# EAGLE design Group_10 (EAGLE 9.6.2)

## Sheet 1 of 2
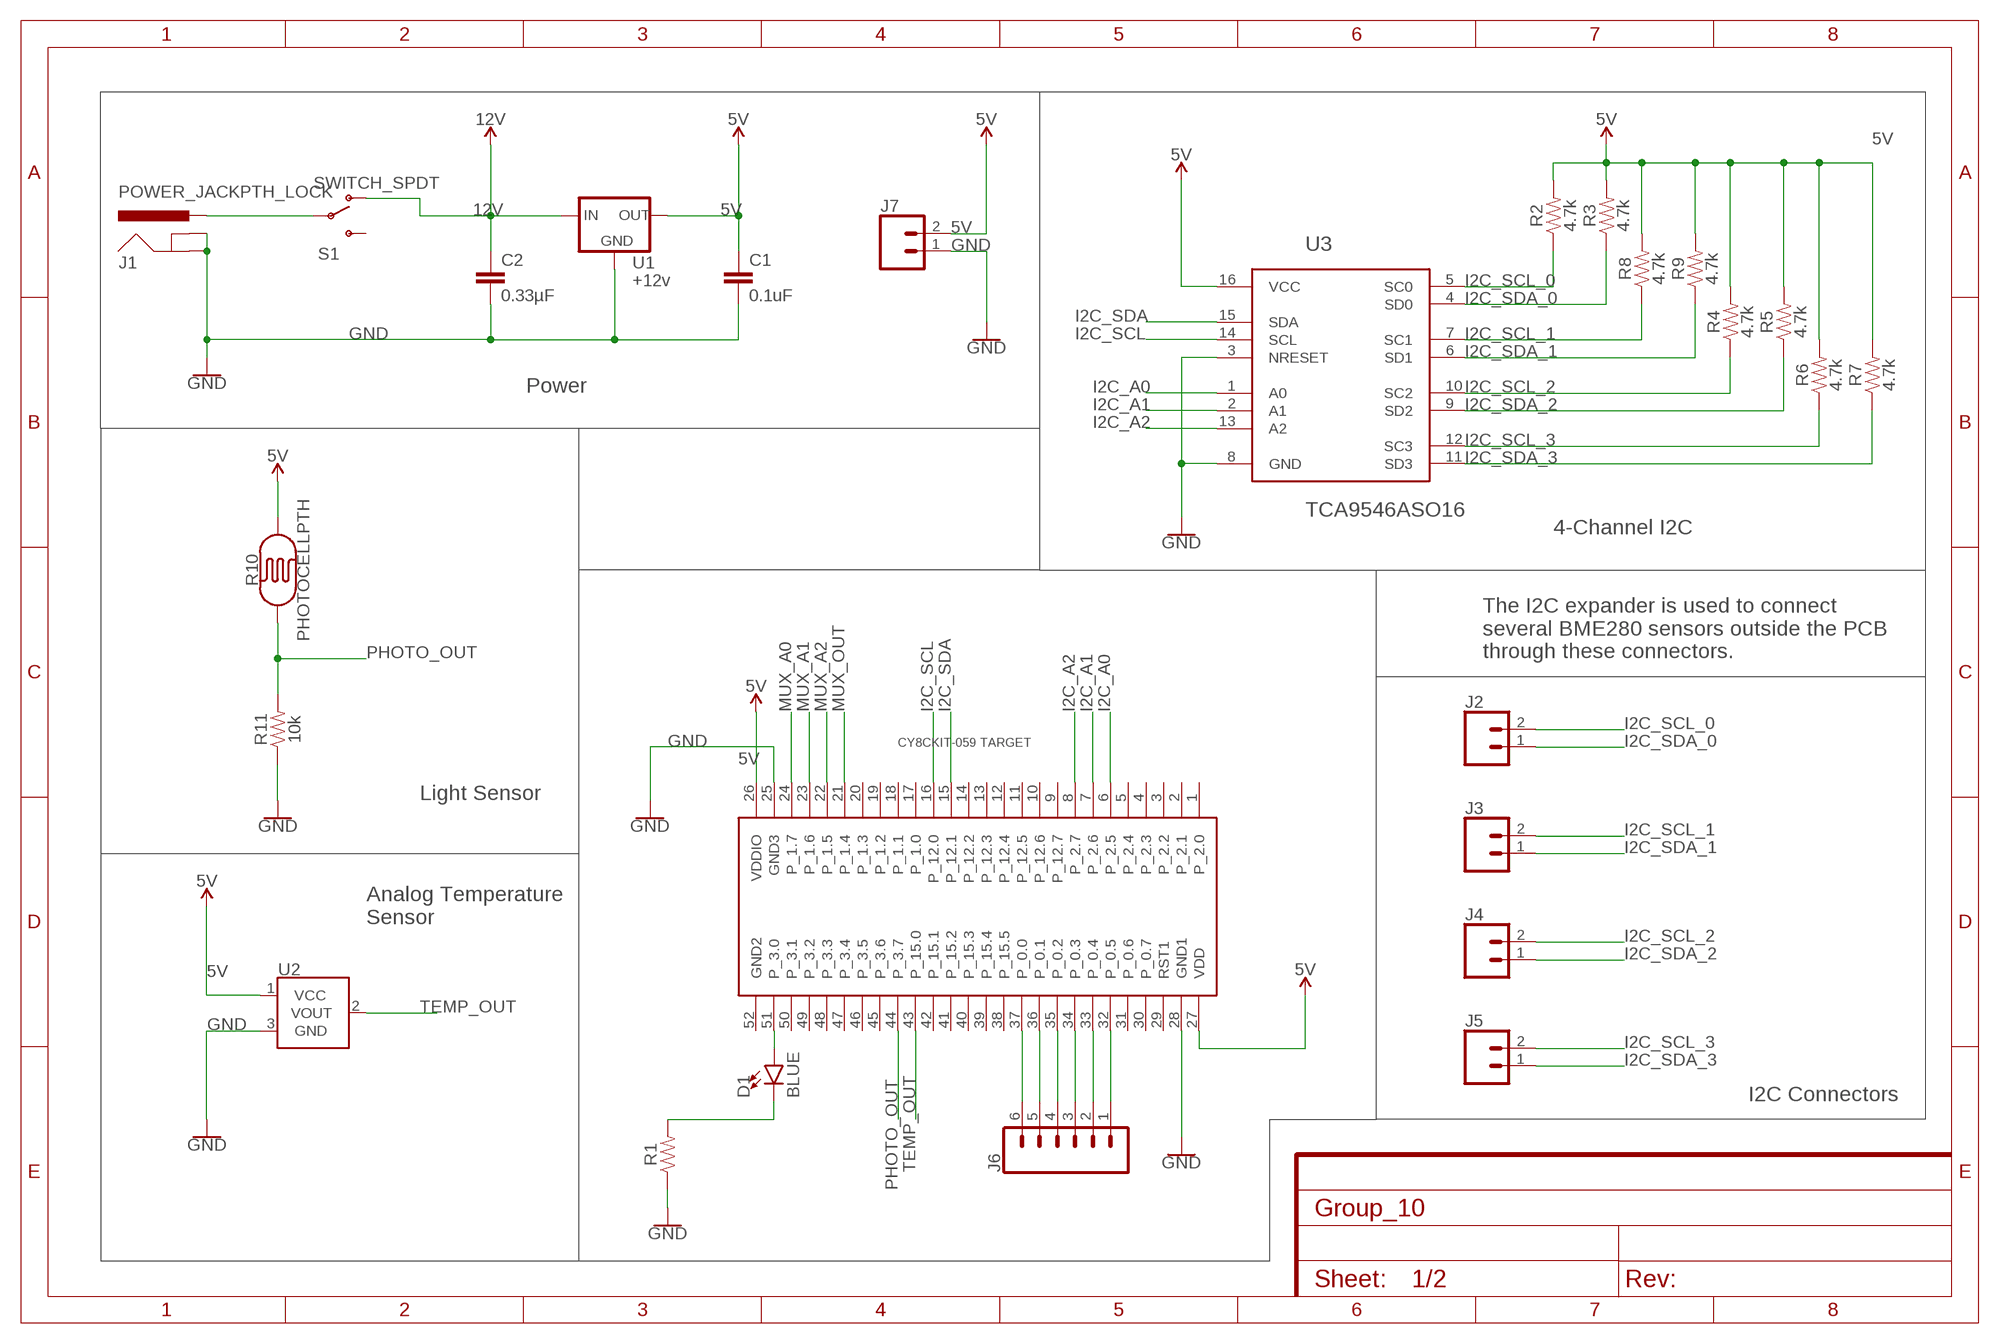
[diagram p0: schematic, sheet 1]

### Parts
C1  0.1uF  0.1UF-KIT-EZ-50V-20%  [CAP-PTH-SMALL-KIT]
C2  0.33µF  0.33UF/330NF-0805-50V-10%  [0805]
D1  BLUE  LED-BLUE1206  [LED-1206]
J1  POWER_JACKPTH_LOCK  [POWER_JACK_PTH_LOCK]
J2  CONN_02  [1X02]
J3  CONN_02  [1X02]
J4  CONN_02  [1X02]
J5  CONN_02  [1X02]
J6  CONN_06LOCK  [1X06_LOCK]
J7  CONN_02  [1X02]
R1  RESISTORAXIAL-0.3  [AXIAL-0.3]
R2  4.7k  4.7KOHM-0603-1/10W-1%  [0603]
R3  4.7k  4.7KOHM-0603-1/10W-1%  [0603]
R4  4.7k  4.7KOHM-0603-1/10W-1%  [0603]
R5  4.7k  4.7KOHM-0603-1/10W-1%  [0603]
R6  4.7k  4.7KOHM-0603-1/10W-1%  [0603]
R7  4.7k  4.7KOHM-0603-1/10W-1%  [0603]
R8  4.7k  4.7KOHM-0603-1/10W-1%  [0603]
R9  4.7k  4.7KOHM-0603-1/10W-1%  [0603]
R10  PHOTOCELLPTH  [PHOTOCELL]
R11  10k  10KOHM-0603-1/10W-1%  [0603]
S1  SWITCH_SPDT  [KPS-1290]
U1  +12v  V_REG_78XX7812  [TO-252]
U2  TMP36GT9  [TO-92]
U3  TCA9546ASO16  [TSSOP16]
U$2  CY8CKIT-059_TARGET_3  [CY8CKIT-059_TARGET_3]

### Nets
5V: C1.1 J7.2 R2.2 R3.2 R4.2 R5.2 R6.2 R7.2 R8.2 R9.2 R10.2 U1.2(OUT) U2.1(VCC) U3.16(VCC) U$2.26(VDDIO) U$2.27(VDD) ; also sheet 2
12V: C2.1 S1.O U1.1(IN)
GND: C1.2 C2.2 J1.GND J1.GNDBREAK J7.1 R1.P$1 R11.1 U1.3(GND) U2.3(GND) U3.3(NRESET) U3.8(GND) U$2.25(GND3) U$2.28(GND1) ; also sheet 2
I2C_A0: U3.1(A0) U$2.6(P_2.5)
I2C_A1: U3.2(A1) U$2.7(P_2.6)
I2C_A2: U3.13(A2) U$2.8(P_2.7)
I2C_SCL: U3.14(SCL) U$2.16(P_12.0)
I2C_SCL_0: J2.2 R2.1 U3.5(SC0)
I2C_SCL_1: J3.2 R8.1 U3.7(SC1)
I2C_SCL_2: J4.2 R4.1 U3.10(SC2)
I2C_SCL_3: J5.2 R6.1 U3.12(SC3)
I2C_SDA: U3.15(SDA) U$2.15(P_12.1)
I2C_SDA_0: J2.1 R3.1 U3.4(SD0)
I2C_SDA_1: J3.1 R9.1 U3.6(SD1)
I2C_SDA_2: J4.1 R5.1 U3.9(SD2)
I2C_SDA_3: J5.1 R7.1 U3.11(SD3)
MUX_A0: U$2.24(P_1.7) ; also sheet 2
MUX_A1: U$2.23(P_1.6) ; also sheet 2
MUX_A2: U$2.22(P_1.5) ; also sheet 2
MUX_OUT: U$2.21(P_1.4) ; also sheet 2
N$1: J1.PWR S1.P
N$2: D1.A U$2.51(P_3.0)
N$3: D1.C R1.P$2
N$4: J6.1 U$2.32(P_0.5)
N$5: J6.2 U$2.33(P_0.4)
N$6: J6.3 U$2.34(P_0.3)
N$7: J6.4 U$2.35(P_0.2)
N$8: J6.5 U$2.36(P_0.1)
N$9: J6.6 U$2.37(P_0.0)
PHOTO_OUT: R10.1 R11.2 U$2.44(P_3.7)
TEMP_OUT: U2.2(VOUT) U$2.43(P_15.0)
Unconnected: S1.S U$2.1(P_2.0) U$2.2(P_2.1) U$2.3(P_2.2) U$2.4(P_2.3) U$2.5(P_2.4) U$2.9(P_12.7) U$2.10(P_12.6) U$2.11(P_12.5) U$2.12(P_12.4) U$2.13(P_12.3) U$2.14(P_12.2) U$2.17(P_1.0) U$2.18(P_1.1) U$2.19(P_1.2) U$2.20(P_1.3) U$2.29(RST1) U$2.30(P_0.7) U$2.31(P_0.6) U$2.38(P_15.5) U$2.39(P_15.4) U$2.40(P_15.3) U$2.41(P_15.2) U$2.42(P_15.1) U$2.45(P_3.6) U$2.46(P_3.5) U$2.47(P_3.4) U$2.48(P_3.3) U$2.49(P_3.2) U$2.50(P_3.1)

### Notes on the sheet
- Power
- 4-Channel I2C
- The I2C expander is used to connect 
  several BME280 sensors outside the PCB
  through these connectors.
- Light Sensor
- Analog Temperature
  Sensor
- I2C Connectors

## Sheet 2 of 2
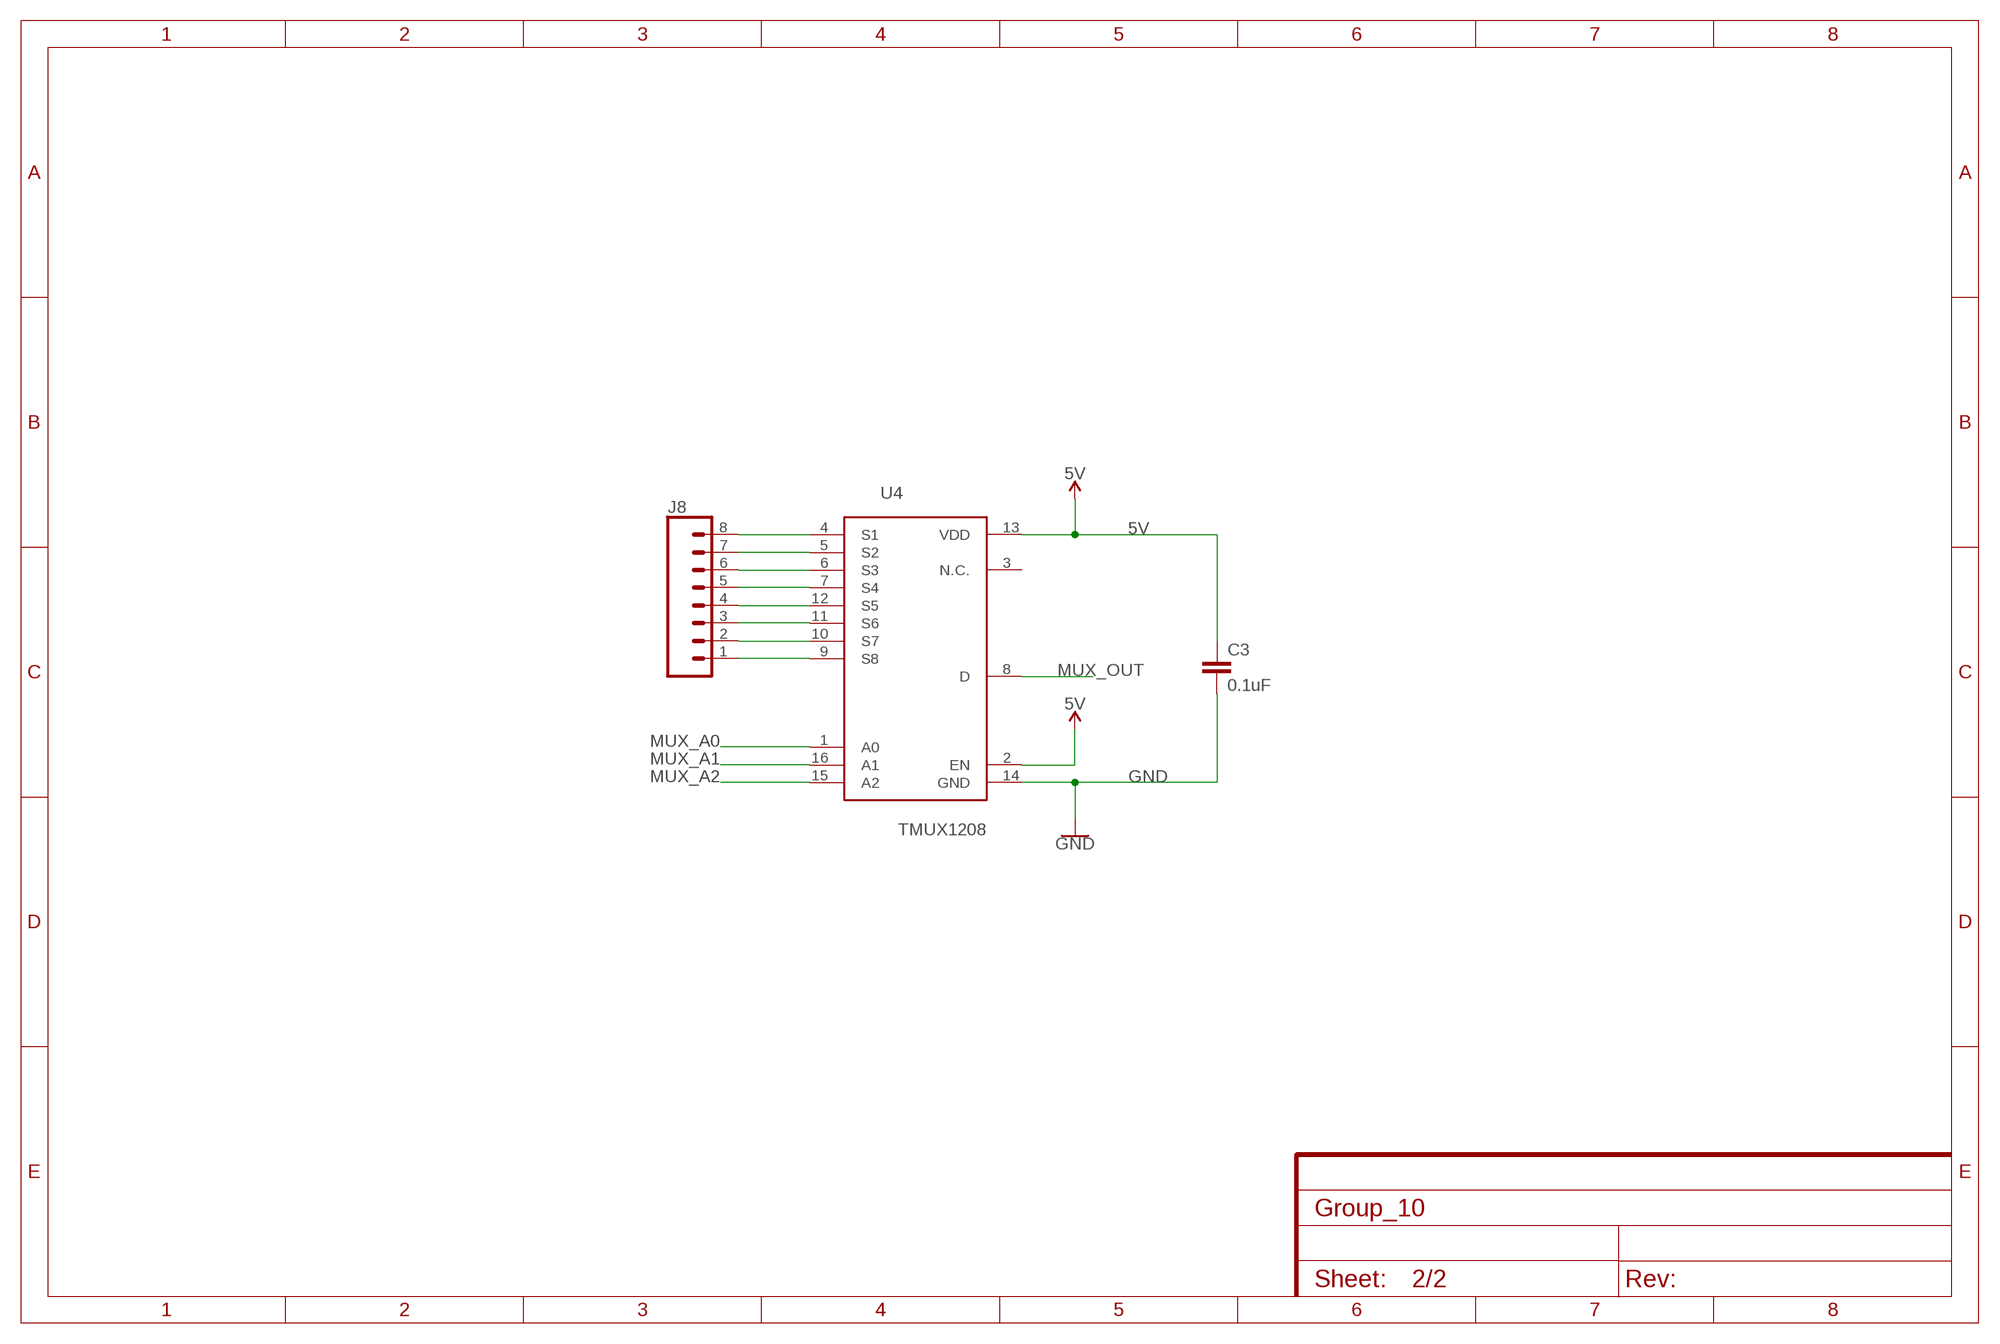
[diagram p1: schematic, sheet 2]

### Parts
C3  0.1uF  0.1UF-KIT-EZ-50V-20%  [CAP-PTH-SMALL-KIT]
J8  CONN_08"  [1X08]
U4  TMUX1208  [QFN16]

### Nets
5V: C3.1 U4.2(EN) U4.13(VDD) ; also sheet 1
GND: C3.2 U4.14(GND) ; also sheet 1
MUX_A0: U4.1(A0) ; also sheet 1
MUX_A1: U4.16(A1) ; also sheet 1
MUX_A2: U4.15(A2) ; also sheet 1
MUX_OUT: U4.8(D) ; also sheet 1
N$10: J8.8 U4.4(S1)
N$11: J8.7 U4.5(S2)
N$12: J8.6 U4.6(S3)
N$13: J8.5 U4.7(S4)
N$14: J8.4 U4.12(S5)
N$15: J8.3 U4.11(S6)
N$16: J8.2 U4.10(S7)
N$17: J8.1 U4.9(S8)
Unconnected: U4.3(N.C.)

## Power pins joined to a net without a drawn wire
GND2: U$2.52(GND2)

## Library data of the parts
C1 C3 = SparkFun-Capacitors:0.1UF: 0.1µF ceramic capacitors A capacitor is a passive two-terminal electrical component used to store electrical energy temporarily in an electric field.; PROD_ID: CAP-08370
C2 = SparkFun-Capacitors:0.33UF/330NF: 0.33µF/330nF ceramic capacitors A capacitor is a passive two-terminal electrical component used to store electrical energy temporarily in an electric field.; PROD_ID: CAP-08469
D1 = SparkFun-LED:LED-BLUE: Blue SMD LED Used in manufacturing of various products at SparkFun Packages: 0603 - SMD 0603 package [Product Link] <http://www.digikey.com/product-detail/en/SMLE12BC7TT86/511-1589-2-ND/1641808> 1206 - SMD1206 package [Product Link] <http://www.digikey.com/product-detail/en/lite-on-inc/LTST-C150TBKT/160-1643-1-ND/573584> SparkFun Products: ESP8266 Thing-Dev Board <https://www.sparkfun.com/products/13711> RedBoard <https://www.sparkfun.com/products/12757>; PROD_ID: DIO-09911
J1 = SparkFun-Connectors:POWER_JACK: Power Jack Connector This is the standard 5.5mm barrel jack for power. The PTH is the most common, proven, reliable, footprint. The Slot footprint only works if the mill layer is transmitted to the PCB fab house so be warned. Here are the connectors we sell at SparkFun: DC Barrel Power Jack/Connector <https://www.sparkfun.com/products/119> (PRT-00119) DC Barrel Power Jack/Connector (SMD) <https://www.sparkfun.com/products/12748> (PRT-12748) DC Barrel Jack Adapter - Breadboard Compatible <https://www.sparkfun.com/products/10811> (PRT-10811) It is used on this SparkFun product (and many, many others): SparkFun RedBoard - Programmed with Arduino <https://www.sparkfun.com/products/12757> (DEV-12757) Also, if you need a mating power supply or connector, please check these out: Wall Adapter Power Supply - 9VDC 650mA <https://www.sparkfun.com/products/298> (TOL-00298) DC Barrel Jack Adapter - Male <https://www.sparkfun.com/products/10287> (PRT-10287); PROD_ID: CONN-08197; SF_ID: PRT-00119
J2-J5 J7 = SparkFun-Connectors:CONN_02: Multi connection point. Often used as Generic Header-pin footprint for 0.1 inch spaced/style header connections On any of the 0.1 inch spaced packages, you can populate with these: Break Away Headers - Straight <https://www.sparkfun.com/products/116> (PRT-00116) Break Away Male Headers - Right Angle <https://www.sparkfun.com/products/553> (PRT-00553) Female Headers <https://www.sparkfun.com/products/115> (PRT-00115) Break Away Headers - Machine Pin <https://www.sparkfun.com/products/117> (PRT-00117) Break Away Female Headers - Swiss Machine Pin <https://www.sparkfun.com/products/743> (PRT-00743) For SCREWTERMINALS and SPRING TERMINALS visit here: Screw Terimnals on SparkFun.com <https://www.sparkfun.com/search/results?term=Screw+Terminals> (5mm/3.5mm/2.54mm spacing) This device is also useful as a general connection point to wire up your design to another part of your project. Our various solder wires solder well into these plated through hole pads. Hook-Up Wire - Assortment (Stranded, 22 AWG) <https://www.sparkfun.com/products/11375> (PRT-11375) Hook-Up Wire - Assortment (Solid Core, 22 AWG) <https://www.sparkfun.com/products/11367> (PRT-11367) View the entire wire category on our website here <https://www.sparkfun.com/categories/141> Special notes: Molex polarized connector foot print use with: PRT-08233 with associated crimp pins and housings. 2.54_SCREWTERM for use with PRT-10571. 3.5mm Screw Terminal footprints for PRT-08084 5mm Screw Terminal footprints for use with PRT-08432
J6 = SparkFun-Connectors:CONN_06: Multi connection point. Often used as Generic Header-pin footprint for 0.1 inch spaced/style header connections On any of the 0.1 inch spaced packages, you can populate with these: Break Away Headers - Straight <https://www.sparkfun.com/products/116> (PRT-00116) Break Away Male Headers - Right Angle <https://www.sparkfun.com/products/553> (PRT-00553) Female Headers <https://www.sparkfun.com/products/115> (PRT-00115) Break Away Headers - Machine Pin <https://www.sparkfun.com/products/117> (PRT-00117) Break Away Female Headers - Swiss Machine Pin <https://www.sparkfun.com/products/743> (PRT-00743) Arduino Stackable Header - 6 Pin <https://www.sparkfun.com/products/9280> (PRT-09280) For SCREWTERMINALS and SPRING TERMINALS visit here: Screw Terimnals on SparkFun.com <https://www.sparkfun.com/search/results?term=Screw+Terminals> (5mm/3.5mm/2.54mm spacing) This device is also useful as a general connection point to wire up your design to another part of your project. Our various solder wires solder well into these plated through hole pads. Hook-Up Wire - Assortment (Stranded, 22 AWG) <https://www.sparkfun.com/products/11375> (PRT-11375) Hook-Up Wire - Assortment (Solid Core, 22 AWG) <https://www.sparkfun.com/products/11367> (PRT-11367) View the entire wire category on our website here <https://www.sparkfun.com/categories/141>
J8 = SparkFun-Connectors:CONN_08: Multi connection point. Often used as Generic Header-pin footprint for 0.1 inch spaced/style header connections On any of the 0.1 inch spaced packages, you can populate with these: Break Away Headers - Straight <https://www.sparkfun.com/products/116> (PRT-00116) Break Away Male Headers - Right Angle <https://www.sparkfun.com/products/553> (PRT-00553) Female Headers <https://www.sparkfun.com/products/115> (PRT-00115) Break Away Headers - Machine Pin <https://www.sparkfun.com/products/117> (PRT-00117) Break Away Female Headers - Swiss Machine Pin <https://www.sparkfun.com/products/743> (PRT-00743) Arduino Stackable Header - 8 Pin <https://www.sparkfun.com/products/9279> (PRT-09279) For SCREWTERMINALS and SPRING TERMINALS visit here: Screw Terimnals on SparkFun.com <https://www.sparkfun.com/search/results?term=Screw+Terminals> (5mm/3.5mm/2.54mm spacing) This device is also useful as a general connection point to wire up your design to another part of your project. Our various solder wires solder well into these plated through hole pads. Hook-Up Wire - Assortment (Stranded, 22 AWG) <https://www.sparkfun.com/products/11375> (PRT-11375) Hook-Up Wire - Assortment (Solid Core, 22 AWG) <https://www.sparkfun.com/products/11367> (PRT-11367) View the entire wire category on our website here <https://www.sparkfun.com/categories/141> Special notes: Molex polarized connector foot print use with SKU : PRT-08231 with associated crimp pins and housings. 1MM SMD Version SKU: PRT-10208 NOTES ON THE VARIANTS LOCK and LOCK_LONGPADS... This footprint was designed to help hold the alignment of a through-hole component (i.e. 6-pin header) while soldering it into place. You may notice that each hole has been shifted either up or down by 0.005 of an inch from it's more standard position (which is a perfectly straight line). This slight alteration caused the pins (the squares in the middle) to touch the edges of the holes. Because they are alternating, it causes a "brace" to hold the component in place. 0.005 has proven to be the perfect amount of "off-center" position when using our standard breakaway headers. Although looks a little odd when you look at the bare footprint, once you have a header in there, the alteration is very hard to notice. Also,if you push a header all the way into place, it is covered up entirely on the bottom side.; PROD_ID: CONN-08438
R1 = SparkFun-Resistors:RESISTOR: Generic Resistor Package
R2-R9 = SparkFun-Resistors:4.7KOHM: 4.7kΩ resistor A resistor is a passive two-terminal electrical component that implements electrical resistance as a circuit element. Resistors act to reduce current flow, and, at the same time, act to lower voltage levels within circuits. - Wikipedia; PROD_ID: RES-07857
R10 = SparkFun-Sensors:PHOTOCELL: Photocell (Photodetector, Photo Resistor, CdS) This is a very small light sensor. A photocell changes (also called a photodetector, photo resistor, CdS or photoconductive cell) resistance depending on the amount of light it is exposed to. These little sensors make great ambient light triggers (when light in the room turns on, do something). Datasheet <http://cdn.sparkfun.com/datasheets/Sensors/LightImaging/SEN-09088.pdf> SparkFun Products Mini Photocell <https://www.sparkfun.com/products/9088> (SEN-09088); PROD_ID: COMP-09129; SF_ID: SEN-09088
R11 = SparkFun-Resistors:10KOHM: 10kΩ resistor A resistor is a passive two-terminal electrical component that implements electrical resistance as a circuit element. Resistors act to reduce current flow, and, at the same time, act to lower voltage levels within circuits. - Wikipedia; PROD_ID: RES-00824
S1 = SparkFun-Retired:SWITCH_SPDT: SWCH-10651 Side-actuated SPDT slide switch, as used on the Arduino Pro; PROD_ID: SWCH-10651
U1 = SparkFun-IC-Power:V_REG_78XX: Voltage Regulator Standard 78xx regulator. IGO (Input Ground Output). Spark Fun Electronics SKU : COM-00107; PROD_ID: VREG-12370
U2 = SparkFun-Sensors:TMP36: TMP36 Precision Analog °C Temperature Sensor The TMP36 is a low voltage, precision centigrade temperature sensor. It provides a voltage output that is linearly proportional to the Celsius temperature. It also doesn’t require any external calibration to provide typical accuracies of ±1°C at +25°C and ±2°C over the −40°C to +125°C temperature range. We like it because it’s so easy to use: Just give the device a ground and 2.7 to 5.5 VDC and read the voltage on the Vout pin. The output voltage can be converted to temperature easily using the scale factor of 10 mV/°C. Datasheet <http://cdn.sparkfun.com/datasheets/Sensors/Temp/TMP35_36_37.pdf> SparkFun Products Temperature Sensor - TMP36 <https://www.sparkfun.com/products/10988> (SEN-10988) SparkFun Danger Shield <https://www.sparkfun.com/products/11649> (DEV-11649); PROD_ID: IC-09880; SF_ID: SEN-10988
U3 = Group_10_Library:TCA9546A: TCA9546A DESCRIPTION The TCA9546A is a quad bidirectional translating switch controlled via the I2C bus. The SCL/SDA upstream pair fans out to four downstream pairs, or channels. Any individual SCn/SDn channel or combination of channels can be selected, determined by the contents of the programmable control register. An active-low reset (RESET) input allows the TCA9546A to recover from a situation in which one of the downstream I2C buses is stuck in a low state. Pulling RESET low resets the I2C state machine and causes all the channels to be deselected, as does the internal power-on reset function. The pass gates of the switches are constructed such that the VCC pin can be used to limit the maximum high voltage, which will be passed by the TCA9546A. This allows the use of different bus voltages on each pair, so that 1.8-V, 2.5-V, or 3.3-V parts can communicate with 5-V parts without any additional protection. External pull-up resistors pull the bus up to the desired voltage level for each channel. All I/O pins are 5.5-V tolerant.
U4 = Group_10_Library:TMUX1208: TMUX1208 DESCRIPTION The TMUX1208 is general purpose complementary metal-oxide semiconductor (CMOS) multiplexers (MUX). The TMUX1208 offers 8:1 singleended channels. Wide operating supply of 1.08 V to 5.5 V allows for use in a broad array of applications from personal electronics to building automation applications. The device supports bidirectional analog and digital signals on the source (Sx) and drain (D) pins ranging from GND to VDD. All logic inputs have 1.8 V logic compatible thresholds, ensuring both TTL and CMOS logic compatibility when operating in the valid supply voltage range. Fail-Safe Logic circuitry allows voltages on the control pins to be applied before the supply pin, protecting the device from potential damage. FEATURES • Rail to Rail Operation • Bidirectional Signal Path • Low On-Resistance: 5 Ω • Wide Supply Range: 1.08 V to 5.5 V • -40°C to +125°C Operating Temperature • 1.8 V Logic Compatible • Fail-Safe Logic • Low Supply Current: 10 nA • Transition Time: 14 ns • Break-Before-Make Switching • ESD Protection HBM: 2000 V • Industry-Standard TSSOP and QFN Packages APPLICATIONS • Analog and Digital Multiplexing / Demultiplexing • HVAC: Heating, Ventilation, and Air Conditioning • Smoke Detectors • Video Surveillance • Electronic Point of Sale • Battery-Powered Equipment • Appliances • Consumer Audio
U$2 = CY8KIT-059:CY8CKIT-059_TARGET_3: CY8CKIT-059 Target This device exposes the pins of the target section of the CY8CKIT-059. This footprint is the one that you will use most of the times, since only the pins of the target section will be then soldered to your PCB.

## Board
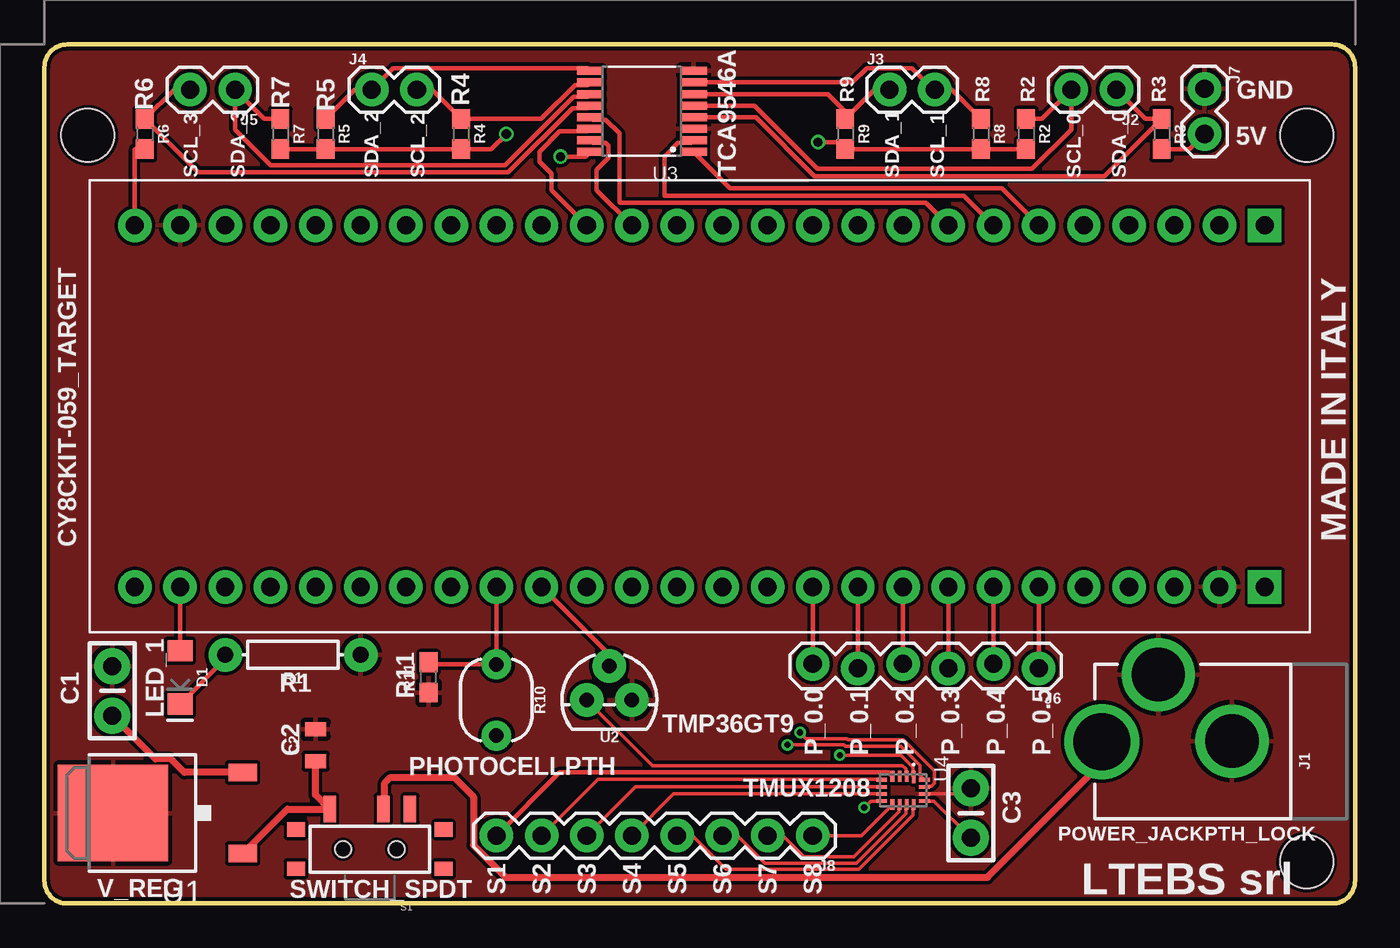
[diagram p2: board, top side]
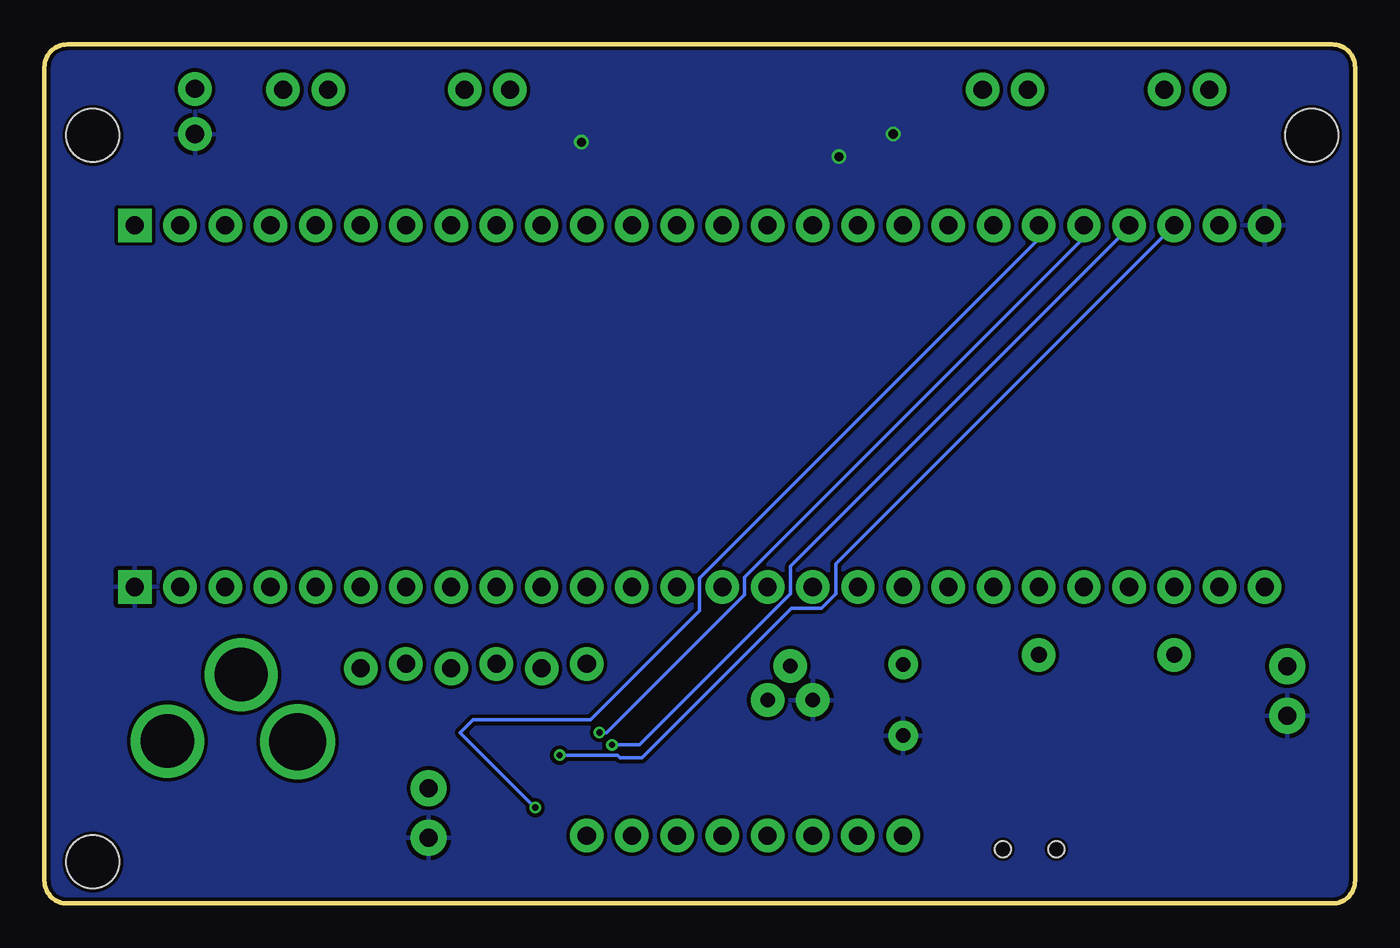
[diagram p3: board, bottom side, seen from below]

Size 73.66 x 48.26 mm. Coordinates in mm from the lower left corner, seen from the top.
Outline: 73.66,46.99 73.66,1.27 arc-90 72.39,0 1.27,0 arc-90 0,1.27 0,46.99 arc-90 1.27,48.26 72.39,48.26 arc-90 73.66,46.99
Copper layers (1*16): Top 0.035mm / dielectric 0.15mm / Bottom 0.035mm
Design rules "Group_10 *": minimum track width 6mil, minimum drill 8mil, track to track 6mil, track to pad 6mil, pad to pad 6mil, via to via 6mil, smd to smd 6mil, copper to edge 8mil, drill to drill 6mil, minimum pad ring 8mil, minimum via ring 6mil, stop-mask expansion 8mil, vias tented up to drill 20mil, thermal gap 10mil
Holes 3 mm at 2.44,43.15 70.94,43.15 70.94,2.34

### Footprints (pad centres in the part's own frame; a part is rotated, then mirrored left to right if it is on the bottom)
CAP-PTH-SMALL-KIT = drill 1.016 pad 2.032: 1 -1.397,0; 2 1.397,0
0805 = smd 0.8 x 1.2: 1 -0.9,0; 2 0.9,0
LED-1206 = smd 1.2 x 1.4: A -1.5,0; C 1.5,0
POWER_JACK_PTH_LOCK = drill 2.997 pad 4.115: GND 0.025,6.557; GNDBREAK 3.762,10.7 | drill 3.2 pad 4.115: PWR 0,13.878
1X02 = drill 1.016 pad 1.88: 1 0,0; 2 2.54,0
1X06_LOCK = drill 1.016 pad 1.88: 1 0,0; 2 2.54,-0.254; 3 5.08,0; 4 7.62,-0.254; 5 10.16,0; 6 12.7,-0.254
1X08 = drill 1.016 pad 1.88: 1 0,0; 2 2.54,0; 3 5.08,0; 4 7.62,0; 5 10.16,0; 6 12.7,0; 7 15.24,0; 8 17.78,0
AXIAL-0.3 = drill 0.9 pad 1.88: P$1 -3.81,0; P$2 3.81,0
0603 = smd 1.1 x 1: 1 -0.85,0; 2 0.85,0
PHOTOCELL = drill 0.8 pad 1.676: 1 -2,0; 2 2,0
KPS-1290 = smd 0.7 x 1.5: O -2.25,2.25; P 0.75,2.25; S 2.25,2.25 | smd 1 x 0.8: P$1 -4.15,1.1; P$2 -4.15,-1.1; P$3 4.15,-1.1; P$4 4.15,1.1 | hole 0.9: -1.5,0; 1.5,0
TO-252 = smd 1 x 1.6: 1 -2.28,-4.8; 2 2.28,-4.8 | smd 5.4 x 6.2: 3 0,2.5
TO-92 = drill 0.813 pad 1.88: 1 -1.27,0; 2 0,1.905; 3 1.27,0
TSSOP16 = smd 1.5 x 0.45: 1 -2.9,2.275; 2 -2.9,1.625; 3 -2.9,0.975; 4 -2.9,0.325; 5 -2.9,-0.325; 6 -2.9,-0.975; 7 -2.9,-1.625; 8 -2.9,-2.275; 9 2.9,-2.275; 10 2.9,-1.625; 11 2.9,-0.975; 12 2.9,-0.325; 13 2.9,0.325; 14 2.9,0.975; 15 2.9,1.625; 16 2.9,2.275
QFN16 = smd 0.7 x 0.2: 1 -0.75,0.6 | smd 0.6 x 0.2: 2 -0.8,0.2; 3 -0.8,-0.2; 4 -0.8,-0.6; 9 0.8,-0.6; 10 0.8,-0.2; 11 0.8,0.2; 12 0.8,0.6 | smd 0.2 x 0.6: 5 -0.6,-1.2; 6 -0.2,-1.2; 7 0.2,-1.2; 8 0.6,-1.2; 13 0.6,1.2; 14 0.2,1.2; 15 -0.2,1.2; 16 -0.6,1.2
CY8CKIT-059_TARGET_3 = drill 1.016 pad 1.876 square: 1 30.48,8.89; 27 30.48,-11.43 | drill 1.016 pad 1.876: 2 27.94,8.89; 3 25.4,8.89; 4 22.86,8.89; 5 20.32,8.89; 6 17.78,8.89; 7 15.24,8.89; 8 12.7,8.89; 9 10.16,8.89; 10 7.62,8.89; 11 5.08,8.89; 12 2.54,8.89; 13 0,8.89; 14 -2.54,8.89; 15 -5.08,8.89; 16 -7.62,8.89; 17 -10.16,8.89; 18 -12.7,8.89; 19 -15.24,8.89; 20 -17.78,8.89; 21 -20.32,8.89; 22 -22.86,8.89; 23 -25.4,8.89; 24 -27.94,8.89; 25 -30.48,8.89; 26 -33.02,8.89; 28 27.94,-11.43; 29 25.4,-11.43; 30 22.86,-11.43; 31 20.32,-11.43; 32 17.78,-11.43; 33 15.24,-11.43; 34 12.7,-11.43; 35 10.16,-11.43; 36 7.62,-11.43; 37 5.08,-11.43; 38 2.54,-11.43; 39 0,-11.43; 40 -2.54,-11.43; 41 -5.08,-11.43; 42 -7.62,-11.43; 43 -10.16,-11.43; 44 -12.7,-11.43; 45 -15.24,-11.43; 46 -17.78,-11.43; 47 -20.32,-11.43; 48 -22.86,-11.43; 49 -25.4,-11.43; 50 -27.94,-11.43; 51 -30.48,-11.43; 52 -33.02,-11.43

### Placement (x,y rotation side)
C1  3.81,11.94 90 top
C2  15.24,8.89 90 top
C3  52.07,5.08 90 top
D1  7.62,12.7 270 top
J1  73.3,9.09 90 top
J2  60.25,45.72 180 top
J3  47.5,45.72 0 top
J4  18.39,45.72 0 top
J5  10.72,45.72 180 top
J6  55.88,13.21 180 top
J7  65.2,45.77 270 top
J8  43.18,3.81 180 top
R1  13.97,13.97 180 top
R2  55.17,43.23 270 top
R3  62.79,43.23 270 top
R4  23.42,43.23 270 top
R5  15.8,43.23 270 top
R6  5.64,43.23 270 top
R7  13.26,43.23 270 top
R8  52.63,43.23 270 top
R9  45.01,43.23 270 top
R10  25.4,11.43 270 top
R11  21.59,12.7 90 top
S1  18.29,3.05 0 top
U1  6.35,5.08 90 top
U2  31.75,11.43 0 top
U3  33.58,44.5 180 top
U4  48.26,6.35 270 top
U$2  38.1,29.21 0 top

### Tracks (layer width: path | path; a pad name or v marks a point on that pad's centre or on a via)
5V  (via drill 0.51)
  Top 0.2: U4.13 50,5.75 C3.1 | U2.1 34.16,7.75 48.22,7.75 48.41,7.55 48.41,7.2 U4.2
  Top 0.254: U3.16 30.41,41.96 v29.01,41.96 | R7.2 R5.2 R4.2 25.11,42.38 v25.96,43.23 | U$2.26 5.08,42.38 R6.2 | v43.49,42.77 44.62,42.77 R9.2 R8.2 R2.2 | R3.2 64.35,42.38 J7.2
  Top 0.381: C1.1 6.23,8.12 7.09,8.12 7.86,7.36 U1.2
  pour Bottom (isolate 0.203): 72.39,0 1.27,0 arc-90 0,1.27 0,46.99 arc-90 1.27,48.26 72.39,48.26 arc-90 73.66,46.99 73.66,1.27 arc-90
12V
  Top 0.381: U1.1 13.65,5.3 S1.O 15.24,6.1 C2.1
GND
  Top 0.2: U4.14 51.74,6.15 C3.2
  pour Top (isolate 0.203): 72.39,0 1.27,0 arc-90 0,1.27 0,46.99 arc-90 1.27,48.26 72.39,48.26 arc-90 73.66,46.99 73.66,1.27 arc-90
I2C_A0
  Top 0.254: U3.1 38.52,40.18 53.8,40.18 U$2.6
I2C_A1
  Top 0.254: U3.2 36.33,42.73 35.61,42.73 34.85,41.97 34.85,39.78 51.67,39.78 U$2.7
I2C_A2
  Top 0.254: U3.13 30.82,44.03 31.55,44.03 32.31,43.27 32.31,39.42 32.36,39.37 49.53,39.37 U$2.8
I2C_SCL
  Top 0.254: U3.14 30.53,43.38 28.95,43.38 27.81,42.25 27.81,41.68 28.5,40.99 28.5,40.08 U$2.16
I2C_SCL_0
  Top 0.254: U3.5 39.9,44.83 43.46,41.28 55.51,41.28 57.71,43.48 J2.2 56.07,44.08 R2.1
I2C_SCL_1
  Top 0.254: R8.1 50.99,45.72 J3.2 49.98,45.72 48.77,46.94 46.23,46.94 45.42,46.13 U3.7
I2C_SCL_2
  Top 0.254: U3.10 30.53,45.98 29.81,45.98 27.91,44.08 R4.1 21.78,45.72 J4.2
I2C_SCL_3
  Top 0.254: U3.12 30.53,44.68 29.67,44.68 26.07,41.07 8.65,41.07 R6.1 7.28,45.72 J5.2
I2C_SDA
  Top 0.254: U3.15 30.82,42.73 31.55,42.73 31.71,42.57 31.71,41.89 31.04,41.22 31.04,40.08 U$2.15
I2C_SDA_0
  Top 0.254: U3.4 39.98,44.18 43.29,40.87 59.58,40.87 R3.1 61.89,44.08 J2.1
I2C_SDA_1
  Top 0.254: R9.1 45.22,44.29 | 45.22,44.29 46.65,45.72 J3.1 | U3.6 44.03,45.48 45.22,44.29
I2C_SDA_2
  Top 0.254: R5.1 17.44,45.72 J4.1 19.61,46.94 30.52,46.94 U3.9
I2C_SDA_3
  Top 0.254: U3.11 30.53,45.33 29.75,45.33 25.9,41.48 12.72,41.48 10.72,43.48 J5.1 12.36,44.08 R7.1
MUX_A0  (via drill 0.35)
  Top 0.2: U4.1 48.81,7.15 48.81,7.65 48.13,8.33 v44.7,8.33
  Bottom 0.2: v44.7,8.33 41.45,8.33 41.3,8.18 40.08,8.18 31.67,16.59 29.99,16.59 29.19,17.39 29.19,19.07 U$2.24
MUX_A1  (via drill 0.35)
  Top 0.2: U4.16 49.21,7.2 49.21,7.75 48.13,8.84 45.02,8.84 44.94,8.91 v41.76,8.91
  Bottom 0.2: U$2.23 12.7,37.97 31.73,18.94 31.73,17.39 40.21,8.91 v41.76,8.91
MUX_A2  (via drill 0.35)
  Top 0.2: U4.15 49.51,6.6 49.87,6.6 50.01,6.75 50.01,7.45 48.27,9.2 45.16,9.2 45.09,9.26 42.81,9.26 v42.47,9.6
  Bottom 0.2: v42.47,9.6 42.06,9.6 34.31,17.34 34.31,18.32 15.24,37.4 U$2.22
MUX_OUT  (via drill 0.35)
  Top 0.2: U4.8 46.44,5.75 v46.08,5.38
  Bottom 0.2: v46.08,5.38 50.29,9.6 49.58,10.31 42.98,10.31 36.85,16.44 36.85,18.27 17.78,37.34 U$2.21
N$1
  Top 0.381: S1.P 19.13,5.39 19.13,6.78 19.43,7.08 23.03,7.08 24.12,5.99 24.12,3.28 25.93,1.47 53,1.47 59.43,7.89 J1.PWR
N$2
  Top 0.254: D1.A U$2.51
N$3
  Top 0.254: R1.P$2 10.16,13.74 D1.C
N$4
  Top 0.254: U$2.32 J6.1
N$5
  Top 0.254: U$2.33 J6.2
N$6
  Top 0.254: U$2.34 J6.3
N$7
  Top 0.254: U$2.35 J6.4
N$8
  Top 0.254: U$2.36 J6.5
N$9
  Top 0.254: U$2.37 J6.6
N$10
  Top 0.254: U4.4 47.44,7.37 28.96,7.37 J8.8
N$11
  Top 0.2: J8.7 31.12,6.98 47.03,6.98 U4.5
N$12
  Top 0.2: J8.6 33.22,6.55 U4.6
N$13
  Top 0.2: J8.5 35.36,6.15 U4.7
N$14
  Top 0.2: U4.12 48.81,5.5 48.81,4.95 45.78,1.91 38.31,1.91 36.41,3.81 J8.4
N$15
  Top 0.2: U4.11 48.41,5.5 48.41,5.05 45.63,2.27 40.5,2.27 38.95,3.81 J8.3
N$16
  Top 0.2: U4.10 48.01,5.5 48.01,5.15 45.49,2.62 42.69,2.62 41.49,3.81 J8.2
N$17
  Top 0.2: J8.1 45.92,3.81 U4.9
PHOTO_OUT
  Top 0.254: U$2.44 R10.1 21.71,13.43 R11.2
TEMP_OUT
  Top 0.254: U$2.43 31.75,13.97 U2.2

### Text on the board
tPlace: R6 | R7 | R5 | R4 | R9 | R8 | R2 | R3 | GND | TCA9546A | 5V | SCL_3 | SDA_3 | SDA_2 | SCL_2 | SDA_1 | SCL_1 | SCL_0 | SDA_0 | CY8CKIT-059_TARGET | MADE IN ITALY | R1 | C1 | R11 | LED_1 | TMP36GT9 | C2 | P_0.0 | P_0.1 | P_0.2 | P_0.3 | P_0.4 | P_0.5 | PHOTOCELLPTH | TMUX1208 | C3 | POWER_JACKPTH_LOCK | V_REG | SWITCH_SPDT | S1 | S2 | S3 | S4 | S5 | S6 | S7 | S8 | LTEBS srl